# EAGLE design reader (EAGLE 7.1.0)
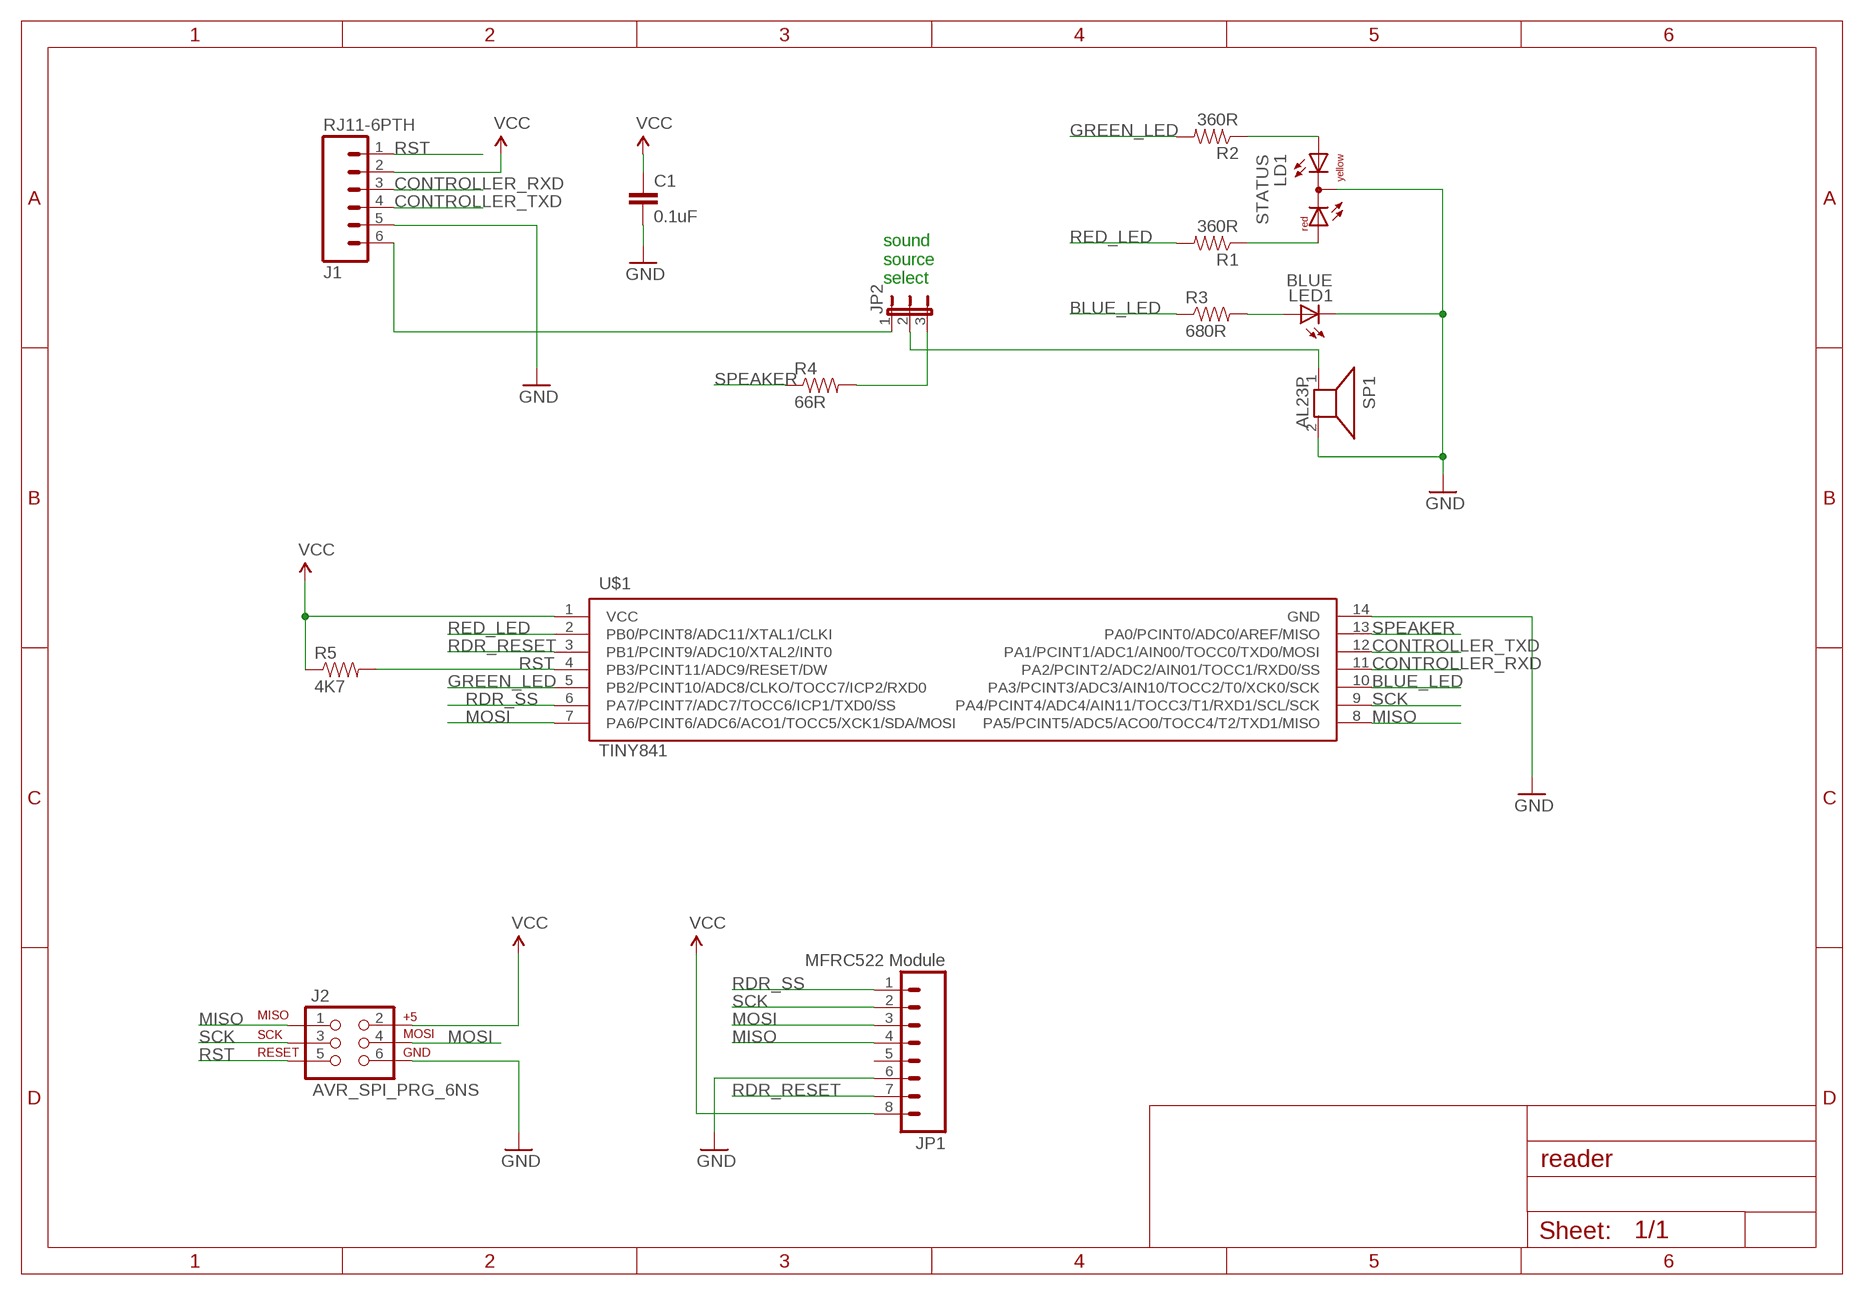
[diagram p0: schematic, sheet 1]

## Parts
C1  0.1uF  0.1UF-50V-20%(PTH)KIT-EZ  [CAP-PTH-SMALL-KIT]
J1  RJ11-6PTH  [RJ11-6]
J2  AVR_SPI_PRG_6NS  [2X3-NS]
JP1  MFRC522 Module  M081X08  [1X08]
JP2  JP2E  [JP2]
LD1  STATUS  DUOLED-RY-C  [DUOLED-C-5MM]
LED1  BLUE  LED3MM  [LED3MM]
R1  360R  RESISTOR0805-RES  [0805]
R2  360R  RESISTOR0805-RES  [0805]
R3  680R  RESISTOR0805-RES  [0805]
R4  66R  RESISTOR0805-RES  [0805]
R5  4K7  RESISTOR0805-RES  [0805]
SP1  AL23P  [AL23P]
U$1  TINY841  [SO14]

## Nets
BLUE_LED: R3.1 U$1.10(PA3/PCINT3/ADC3/AIN10/TOCC2/T0/XCK0/SCK)
CONTROLLER_RXD: J1.3 U$1.11(PA2/PCINT2/ADC2/AIN01/TOCC1/RXD0/SS)
CONTROLLER_TXD: J1.4 U$1.12(PA1/PCINT1/ADC1/AIN00/TOCC0/TXD0/MOSI)
EXT_SPEAKER: J1.6 JP2.1
GND: C1.2 J1.5 J2.6 JP1.6 LD1.C LED1.K(C) SP1.2 U$1.14(GND)
GREEN_LED: R2.2 U$1.5(PB2/PCINT10/ADC8/CLKO/TOCC7/ICP2/RXD0)
MISO: J2.1 JP1.4 U$1.8(PA5/PCINT5/ADC5/ACO0/TOCC4/T2/TXD1/MISO)
MOSI: J2.4 JP1.3 U$1.7(PA6/PCINT6/ADC6/ACO1/TOCC5/XCK1/SDA/MOSI)
N$1: JP2.2 SP1.1
N$2: LD1.AR R1.1
N$3: LD1.AX(AY) R2.1
N$6: LED1.A R3.2
N$9: JP2.3 R4.2
RDR_RESET: JP1.7 U$1.3(PB1/PCINT9/ADC10/XTAL2/INT0)
RDR_SS: JP1.1 U$1.6(PA7/PCINT7/ADC7/TOCC6/ICP1/TXD0/SS)
RED_LED: R1.2 U$1.2(PB0/PCINT8/ADC11/XTAL1/CLKI)
RST: J1.1 J2.5 R5.2 U$1.4(PB3/PCINT11/ADC9/RESET/DW)
SCK: J2.3 JP1.2 U$1.9(PA4/PCINT4/ADC4/AIN11/TOCC3/T1/RXD1/SCL/SCK)
SPEAKER: R4.1 U$1.13(PA0/PCINT0/ADC0/AREF/MISO)
VCC: C1.1 J1.2 J2.2 JP1.8 R5.1 U$1.1(VCC)
Unconnected: JP1.5

## Notes on the sheet
- sound
  source
  select

## Library data of the parts
C1 = SparkFun-Capacitors:0.1UF-50V-20%(PTH): CAP-08370; PROD_ID: CAP-08370
J1 = SparkFun-Connectors:RJ11-6: RJ11 Jack Simple 6 pin RJ11 jack. Commonly found on CAT3 devices and Microchip programmers. SKU: PRT-00132
J2 = SparkFun-Connectors:AVR_SPI_PRG_6: AVR ISP 6 Pin This is the reduced ISP connector for AVR programming. Common on Arduino. This footprint will take up less PCB space and can be used with a 10-pin to 6-pin adapter such as SKU: BOB-08508 **Special note about "TEST_POINT" package. The stop mask is on the top side, so if you want your programming test points to be on the bottom of your board, make sure to place this package on the bottom side of the board. This also ensure that the orientation to program from the bottom side will be correct.
JP1 = SparkFun-Connectors:M08: Header 8 Standard 8-pin 0.1" header. Use with straight break away headers (SKU : PRT-00116), right angle break away headers (PRT-00553), swiss pins (PRT-00743), machine pins (PRT-00117), and female headers (PRT-00115).
JP2 = jumper:JP2E: JUMPER
LD1 = led:DUOLED-RY-C: DUO LED 2 colors (red/yellow), 5 mm, round, common Cathode www.ligitek.com or other producers.
LED1 = led:LED: LED OSRAM: - CHIPLED LG R971, LG N971, LY N971, LG Q971, LY Q971, LO R971, LY R971 LH N974, LH R974 LS Q976, LO Q976, LY Q976 LO Q996 - Hyper CHIPLED LW Q18S LB Q993, LB Q99A, LB R99A - SideLED LS A670, LO A670, LY A670, LG A670, LP A670 LB A673, LV A673, LT A673, LW A673 LH A674 LY A675 LS A676, LA A676, LO A676, LY A676, LW A676 LS A679, LY A679, LG A679 - Hyper Micro SIDELED® LS Y876, LA Y876, LO Y876, LY Y876 LT Y87S - SmartLED LW L88C, LW L88S LB L89C, LB L89S, LG L890 LS L89K, LO L89K, LY L89K LS L896, LA L896, LO L896, LY L896 - TOPLED LS T670, LO T670, LY T670, LG T670, LP T670 LSG T670, LSP T670, LSY T670, LOP T670, LYG T670 LG T671, LOG T671, LSG T671 LB T673, LV T673, LT T673, LW T673 LH T674 LS T676, LA T676, LO T676, LY T676, LB T676, LH T676, LSB T676, LW T676 LB T67C, LV T67C, LT T67C, LS T67K, LO T67K, LY T67K, LW E67C LS E67B, LA E67B, LO E67B, LY E67B, LB E67C, LV E67C, LT E67C LW T67C LS T679, LY T679, LG T679 LS T770, LO T770, LY T770, LG T770, LP T770 LB T773, LV T773, LT T773, LW T773 LH T774 LS E675, LA E675, LY E675, LS T675 LS T776, LA T776, LO T776, LY T776, LB T776 LHGB T686 LT T68C, LB T68C - Hyper Mini TOPLED® LB M676 - Mini TOPLED Santana® LG M470 LS M47K, LO M47K, LY M47K Source: http://www.osram.convergy.de LUXEON: - LUMILED® LXK2-PW12-R00, LXK2-PW12-S00, LXK2-PW14-U00, LXK2-PW14-V00 LXK2-PM12-R00, LXK2-PM12-S00, LXK2-PM14-U00 LXK2-PE12-Q00, LXK2-PE12-R00, LXK2-PE12-S00, LXK2-PE14-T00, LXK2-PE14-U00 LXK2-PB12-K00, LXK2-PB12-L00, LXK2-PB12-M00, LXK2-PB14-N00, LXK2-PB14-P00, LXK2-PB14-Q00 LXK2-PR12-L00, LXK2-PR12-M00, LXK2-PR14-Q00, LXK2-PR14-R00 LXK2-PD12-Q00, LXK2-PD12-R00, LXK2-PD12-S00 LXK2-PH12-R00, LXK2-PH12-S00 LXK2-PL12-P00, LXK2-PL12-Q00, LXK2-PL12-R00 Source: www.luxeon.com KINGBRIGHT: KA-3528ASYC Source: www.kingbright.com
R1-R5 = SparkFun-Passives:RESISTOR: Resistor Basic schematic elements and footprints for 0603, 1206, and PTH resistors.
SP1 = buzzer:AL23P: SPEAKER Source: Buerklin; OC_FARNELL: unknown; OC_NEWARK: unknown
U$1 = attiny841:TINY841

## Net classes
0 default: width 0.61 mm

## Board
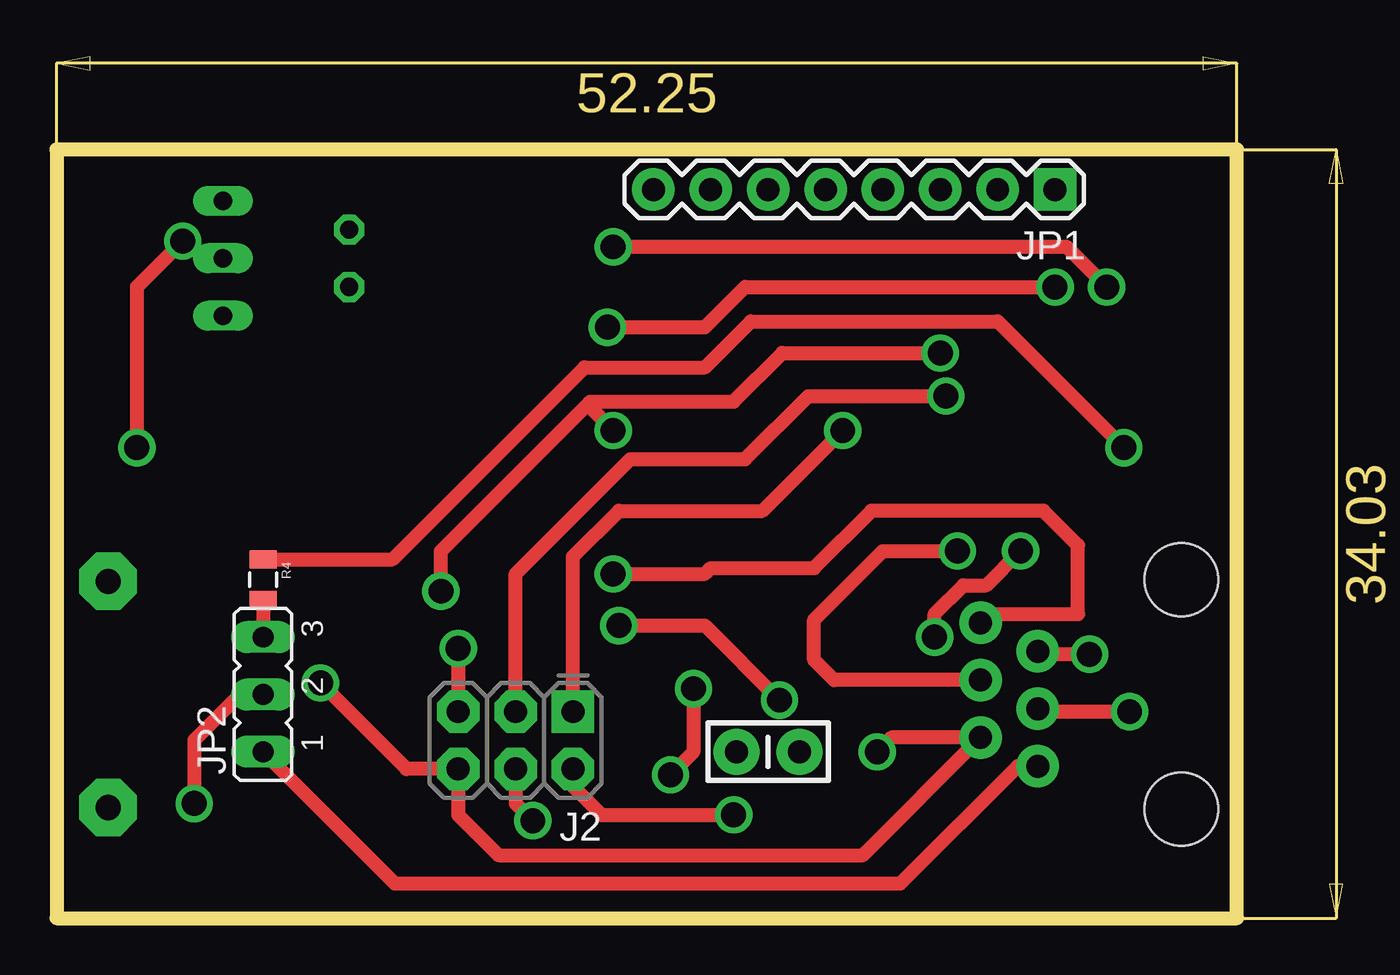
[diagram p1: board, top side]
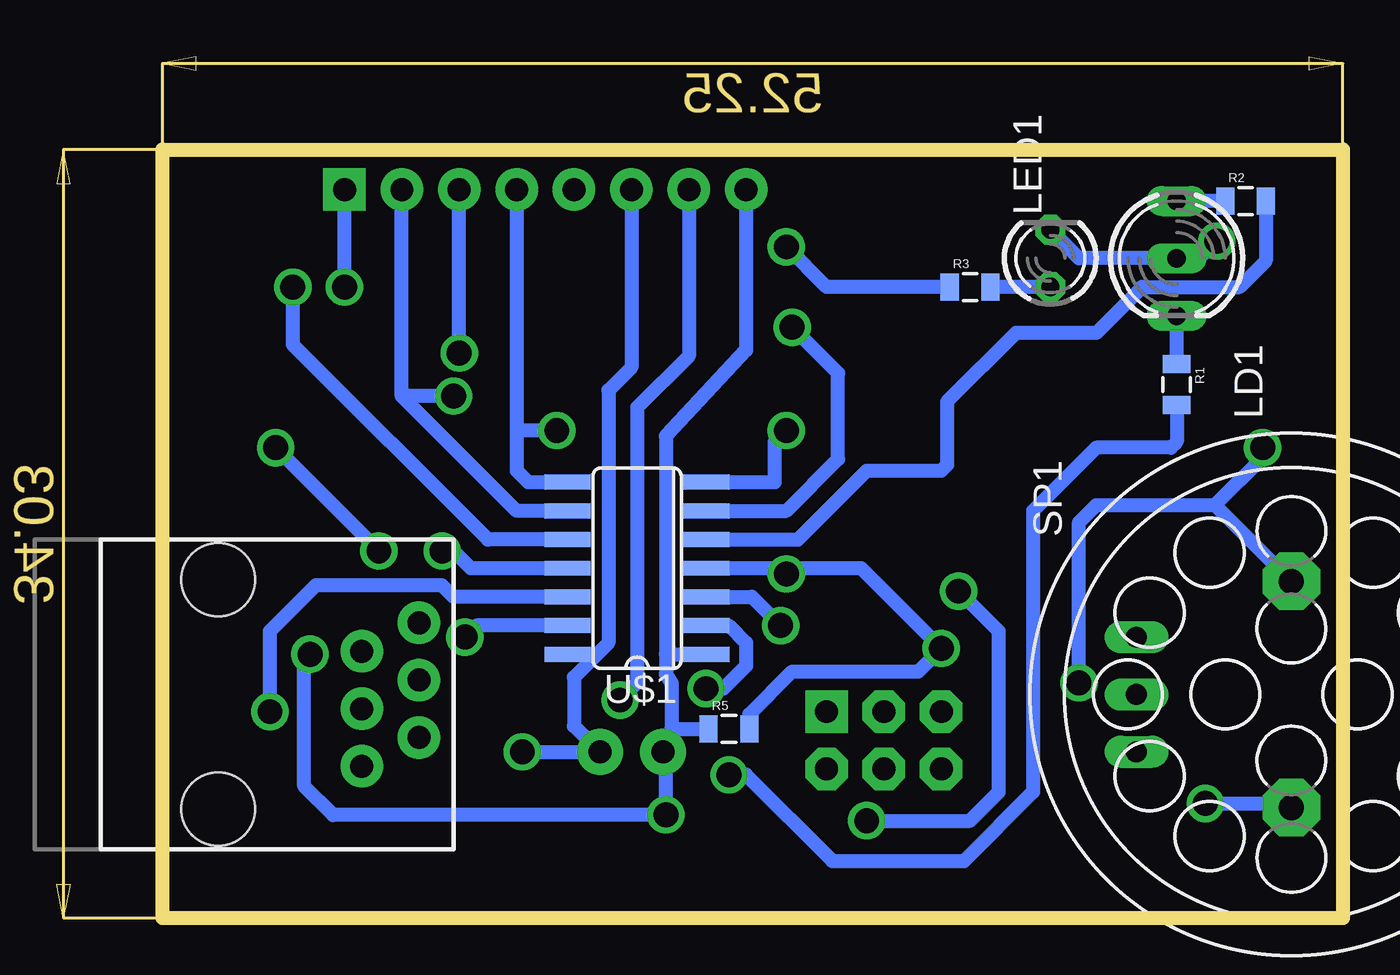
[diagram p2: board, bottom side, seen from below]

Size 52.25 x 34.03 mm. Coordinates in mm from the lower left corner, seen from the top.
Outline: 0,0 52.25,0 52.25,34.03 0,34.03 0,0
Copper layers (1*16): Top 0.035mm / dielectric 1.5mm / Bottom 0.035mm
Design rules "default *": minimum track width 2mil, minimum drill 24mil, track to track 8mil, track to pad 8mil, pad to pad 8mil, via to via 8mil, smd to smd 8mil, copper to edge 20mil, drill to drill 8mil, minimum pad ring 10mil, minimum via ring 8mil, stop-mask expansion 4mil, vias tented up to drill 0mil, thermal gap 10mil

### Footprints (pad centres in the part's own frame; a part is rotated, then mirrored left to right if it is on the bottom)
CAP-PTH-SMALL-KIT = drill 1.016 pad 2.032: 1 -1.397,0; 2 1.397,0
RJ11-6 = drill 1.016 pad 1.88: 1 1.905,8.89; 2 3.175,6.35; 3 4.445,8.89; 4 5.715,6.35; 5 6.985,8.89; 6 8.255,6.35 | hole 3.251: 0,0; 10.16,0
2X3-NS = drill 1.016 pad 1.88 square: 1 -2.54,-1.27 | drill 1.016 pad 1.88 octagon: 2 -2.54,1.27; 3 0,-1.27; 4 0,1.27; 5 2.54,-1.27; 6 2.54,1.27
1X08 = drill 1.016 pad 1.88 square: 1 0,0 | drill 1.016 pad 1.88: 2 2.54,0; 3 5.08,0; 4 7.62,0; 5 10.16,0; 6 12.7,0; 7 15.24,0; 8 17.78,0
JP2 = drill 0.914 long: 1 -2.54,0; 2 0,0; 3 2.54,0
DUOLED-C-5MM = drill 0.813 long: AR 2.54,0; AX -2.54,0; C 0,0
LED3MM = drill 0.813 octagon: A -1.27,0; K 1.27,0
0805 = smd 0.8 x 1.2: 1 -0.9,0; 2 0.9,0
AL23P = drill 1.118 pad 2.54 octagon: 1 -5.004,0; 2 5.004,0
SO14 = smd 0.66 x 2.032: 1 -3.81,-3.073; 2 -2.54,-3.073; 3 -1.27,-3.073; 4 0,-3.073; 5 1.27,-3.073; 6 2.54,-3.073; 7 3.81,-3.073; 8 3.81,3.073; 9 2.54,3.073; 10 1.27,3.073; 11 0,3.073; 12 -1.27,3.073; 13 -2.54,3.073; 14 -3.81,3.073

### Placement (x,y rotation side)
C1  31.5,7.37 0 top
J1  49.78,14.99 270 bottom
J2  20.32,7.87 180 top
JP1  44.2,32.26 180 top
JP2  9.14,9.91 90 top
LD1  7.37,29.21 270 bottom
LED1  12.95,29.21 90 bottom
R1  7.37,23.62 270 bottom
R2  4.32,31.75 0 bottom
R3  16.51,27.94 0 bottom
R4  9.14,14.99 270 top
R5  27.18,8.38 0 bottom
SP1  2.29,9.91 90 bottom
U$1  31.24,15.49 90 bottom

### Tracks (layer width: path | path; a pad name or v marks a point on that pad's centre or on a via)
BLUE_LED  (via drill 1.1)
  Top 0.61: v24.64,29.72 44.7,29.72 v46.48,27.94
  Bottom 0.61: U$1.10 37.85,16.76 46.48,25.4 v46.48,27.94 | R3.1 22.86,27.94 v24.64,29.72
CONTROLLER_RXD  (via drill 1.1)
  Top 0.61: J1.3 34.42,10.54 33.53,11.43 33.53,13.21 36.58,16.26 v39.88,16.26
  Bottom 0.61: v39.88,16.26 39.37,16.26 38.61,15.49 U$1.11
CONTROLLER_TXD  (via drill 1.1)
  Top 0.61: v47.5,9.14 43.56,9.14 J1.4
  Bottom 0.61: U$1.12 39.37,14.22 39.88,14.73 45.47,14.73 47.5,12.7 v47.5,9.14
EXT_SPEAKER
  Top 0.61: J1.6 42.55,6.73 37.34,1.52 14.99,1.52 JP2.1
GND  (via drill 1.1)
  Top 0.61: v36.32,7.37 36.96,8 J1.5 35.69,2.79 19.56,2.79 17.78,4.57 J2.6 15.49,6.6 v11.68,10.41 | v5.59,29.97 3.56,27.94 v3.56,20.83
  Bottom 0.61: JP1.6 31.5,24.38 32.51,23.37 32.51,12.19 33.02,11.68 | 33.02,11.68 U$1.14 | v36.32,7.37 C1.2 34.04,8.51 34.04,10.67 33.02,11.68 | LED1.K 11.68,29.21 LD1.C 6.35,29.21 v5.59,29.97 | v11.68,10.41 11.68,17.53 10.92,18.29 5.66,18.29 | 5.66,18.29 SP1.2 | v3.56,20.83 3.56,20.4 5.66,18.29
GREEN_LED
  Bottom 0.61: U$1.5 24.13,16.76 21.08,19.81 17.78,19.81 17.53,20.07 17.53,22.86 14.48,25.91 10.92,25.91 8.89,27.94 4.57,27.94 3.42,29.09 R2.2
MISO  (via drill 1.1)
  Top 0.61: J2.1 22.86,16 24.89,18.03 31.24,18.03 v34.8,21.59
  Bottom 0.61: JP1.4 36.58,21.59 | 36.58,21.59 36.58,19.81 36.07,19.3 U$1.8 | v34.8,21.59 36.58,21.59
MOSI  (via drill 1.1)
  Top 0.61: J2.4 20.32,5.08 v21.08,4.32 | v39.12,25.02 32.13,25.02 29.97,22.86 23.62,22.86 23.5,22.73 | v17.02,14.48 17.02,16.26 23.5,22.73 | v24.64,21.59 23.5,22.73
  Bottom 0.61: U$1.7 25.15,19.3 25.15,21.08 v24.64,21.59 | v21.08,4.32 16.51,4.32 15.24,5.59 15.24,12.7 v17.02,14.48 | v39.12,25.02 JP1.3
N$1  (via drill 1.1)
  Top 0.61: JP2.2 8.13,9.91 6.1,7.87 v6.1,5.08
  Bottom 0.61: v6.1,5.08 2.46,5.08 SP1.1
N$2
  Bottom 0.61: R1.1 LD1.AR
N$3
  Bottom 0.61: R2.1 LD1.AX
N$6
  Bottom 0.61: LED1.A R3.2
N$9
  Top 0.61: R4.2 JP2.3
RDR_RESET  (via drill 1.1)
  Top 0.61: v24.89,12.95 28.7,12.95 v32,9.65
  Bottom 0.61: JP1.7 28.96,24.89 31.24,22.61 31.24,10.41 v32,9.65 | U$1.3 26.16,14.22 v24.89,12.95
RDR_SS  (via drill 1.1)
  Top 0.61: v24.38,26.16 28.7,26.16 30.48,27.94 v44.2,27.94
  Bottom 0.61: U$1.6 24.64,18.03 22.35,20.32 22.35,24.13 v24.38,26.16 | v44.2,27.94 JP1.1
RED_LED  (via drill 1.1)
  Top 0.61: v28.19,10.16 28.19,7.37 v27.18,6.35
  Bottom 0.61: U$1.2 27.18,12.95 26.42,12.19 26.42,11.18 27.43,10.16 v28.19,10.16 | v27.18,6.35 26.42,6.35 22.61,2.54 16.76,2.54 13.72,5.59 13.72,18.03 10.92,20.83 7.62,20.83 7.37,21.08 R1.2
RST  (via drill 1.1)
  Top 0.61: J1.1 40.89,13.46 45.21,13.46 45.21,16.51 43.69,18.03 36.07,18.03 33.53,15.49 28.96,15.49 28.7,15.24 v24.64,15.24 | v17.78,11.94 J2.5
  Bottom 0.61: R5.2 26.28,9.03 24.38,10.92 18.8,10.92 v17.78,11.94 21.34,15.49 U$1.4 24.89,15.49 v24.64,15.24
SCK  (via drill 1.1)
  Top 0.61: J2.3 20.32,15.24 25.4,20.32 30.48,20.32 33.27,23.11 v39.37,23.11
  Bottom 0.61: U$1.9 36.58,18.03 41.53,22.99 | 41.53,22.99 41.66,23.11 JP1.2 | v39.37,23.11 41.4,23.11 41.53,22.99
SPEAKER  (via drill 1.1)
  Top 0.61: R4.1 14.87,15.89 23.37,24.38 28.7,24.38 30.73,26.42 41.66,26.42 v47.24,20.83 | v38.86,12.45 38.86,13.46 40.13,14.73 41.15,14.73 v42.67,16.26
  Bottom 0.61: U$1.13 38.35,12.95 v38.86,12.45 | v42.67,16.26 v47.24,20.83
VCC  (via drill 1.1)
  Top 0.61: J2.2 22.86,5.84 24.13,4.57 v29.97,4.57 | v45.72,11.68 43.56,11.68 J1.2
  Bottom 0.61: JP1.8 26.42,25.15 29.97,21.34 29.97,11.68 | 29.97,11.68 U$1.1 | 29.72,8.37 C1.1 29.97,7.24 v29.97,4.57 44.7,4.57 45.97,5.84 45.97,11.43 v45.72,11.68 | 29.72,8.37 R5.1 | 29.97,11.68 29.97,10.79 29.72,10.41 29.72,8.37